# EAGLE schematic Mainboard (EAGLE 7.5.0)
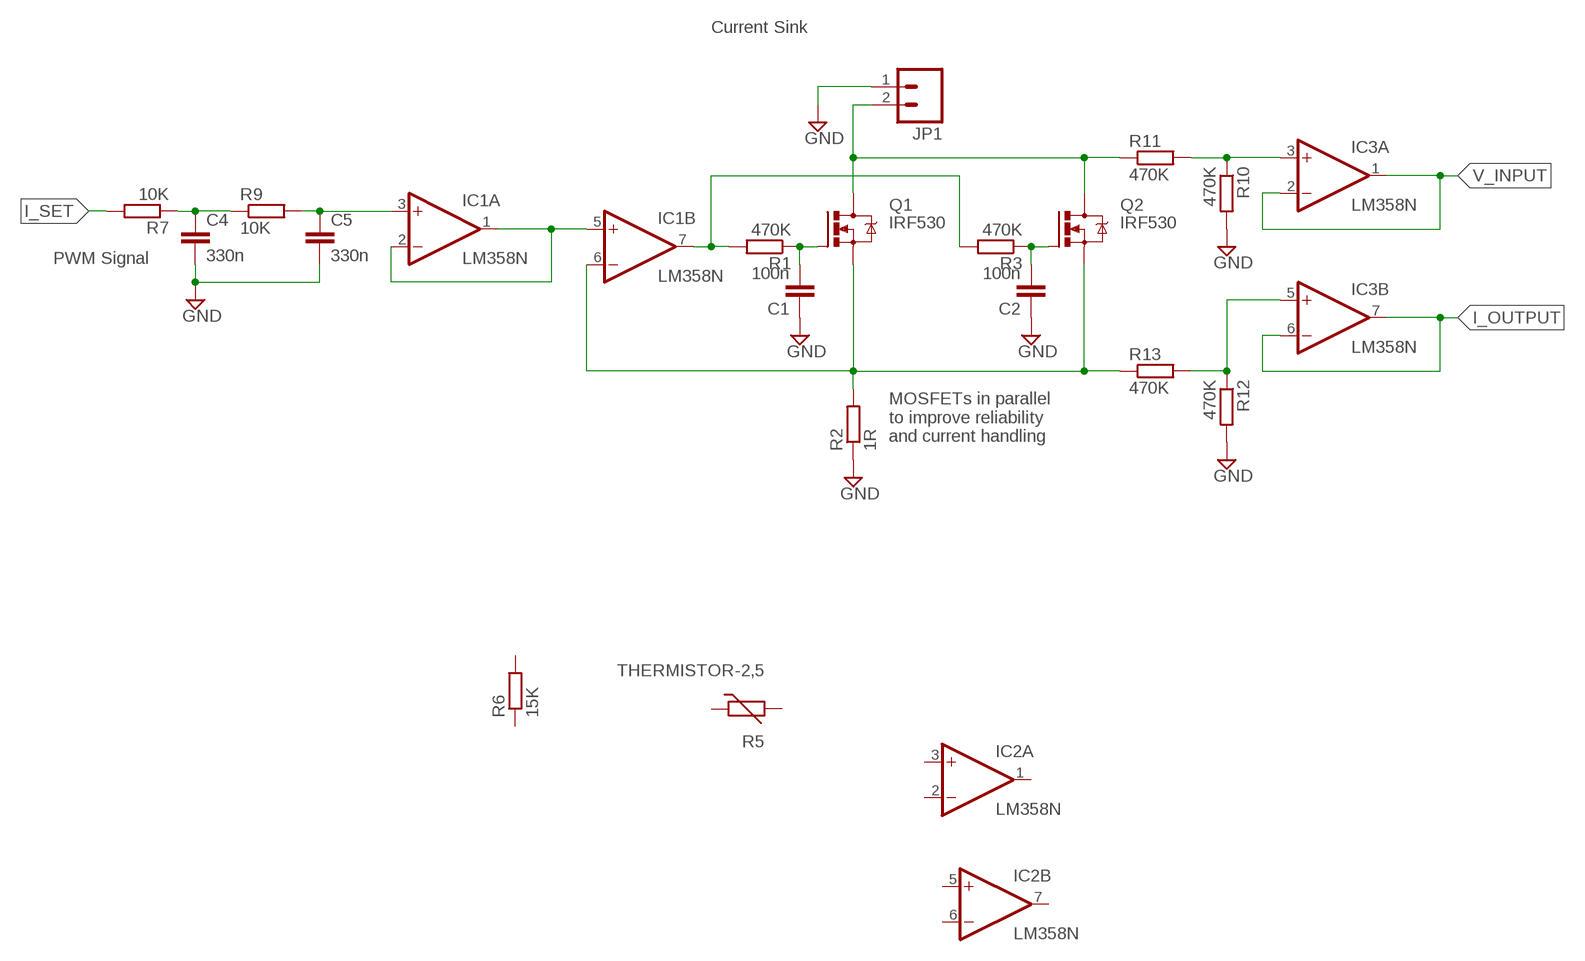
[diagram p0: schematic, sheet 1]

## Parts
C1  100n  C-EU025-025X050  [C025-025X050]
C2  100n  C-EU025-025X050  [C025-025X050]
C4  330n  C-EU025-025X050  [C025-025X050]
C5  330n  C-EU025-025X050  [C025-025X050]
IC1  LM358N  [DIL08]
IC2  LM358N  [DIL08]
IC3  LM358N  [DIL08]
JP1  M02POLAR_LOCK  [MOLEX-1X2_LOCK]
Q1  IRF530  [TO220BV]
Q2  IRF530  [TO220BV]
R1  470K  R-EU_0204/7  [0204/7]
R2  1R  R-EU_0204/7  [0204/7]
R3  470K  R-EU_0204/7  [0204/7]
R5  THERMISTOR-2,5  [RS-2,5]
R6  15K  R-EU_0204/7  [0204/7]
R7  10K  R-EU_0204/7  [0204/7]
R9  10K  R-EU_0204/7  [0204/7]
R10  470K  R-EU_0204/7  [0204/7]
R11  470K  R-EU_0204/7  [0204/7]
R12  470K  R-EU_0204/7  [0204/7]
R13  470K  R-EU_0204/7  [0204/7]

## Nets
GND: C1.1 C2.1 C4.2 C5.2 JP1.1 R2.1 R10.2 R12.2
I_OUTPUT: IC3.6(B:-IN) IC3.7(B:OUT)
N$1: IC1.7(B:OUT) R1.2 R3.2
N$2: C1.2 Q1.G R1.1
N$3: C2.2 Q2.G R3.1
N$4: IC1.6(B:-IN) Q1.S Q2.S R2.2 R13.1
N$5: JP1.2 Q1.D Q2.D R11.1
N$6: IC1.1(A:OUT) IC1.2(A:-IN) IC1.5(B:+IN)
N$8: C5.1 R9.2
N$9: C4.1 R7.1 R9.1
N$11: IC3.3(A:+IN) R10.1 R11.2
N$12: IC3.5(B:+IN) R12.1 R13.2
V_INPUT: IC3.1(A:OUT) IC3.2(A:-IN)
Unconnected: IC1.3(A:+IN) IC2.1(A:OUT) IC2.2(A:-IN) IC2.3(A:+IN) IC2.5(B:+IN) IC2.6(B:-IN) IC2.7(B:OUT) R5.1 R5.2 R6.1 R6.2 R7.2

## Notes on the sheet
- Current Sink
- PWM Signal
- MOSFETs in parallel 
  to improve reliability 
  and current handling

## Power pins joined to a net without a drawn wire
V+: IC1.8(P:V+) IC2.8(P:V+) IC3.8(P:V+)
V-: IC1.4(P:V-) IC2.4(P:V-) IC3.4(P:V-)

## Library data of the parts
C1 C2 C4 C5 = rcl:C-EU: CAPACITOR, European symbol
IC1-IC3 = linear:LM358: OP AMP also LM158; LM258; LM2904 Source: http://cache.national.com/ds/LM/LM158.pdf
JP1 = SparkFun-Connectors:M02: Standard 2-pin 0.1" header. Use with - straight break away headers ( PRT-00116) - right angle break away headers (PRT-00553) - swiss pins (PRT-00743) - machine pins (PRT-00117) - female headers (PRT-00115) Molex polarized connector foot print use with: PRT-08233 with associated crimp pins and housings. 2.54_SCREWTERM for use with PRT-10571. 3.5mm Screw Terminal footprints for PRT-08084 5mm Screw Terminal footprints for use with PRT-08432
Q1 Q2 = transistor-power:IRF530: HEXFET Power MOSFET
R1-R3 R6 R7 R9-R13 = rcl:R-EU_: RESISTOR, European symbol
R5 = varistor:THERMISTOR: THERMISTOR